# Altium schematic sheet lcd.SchDoc
size A4
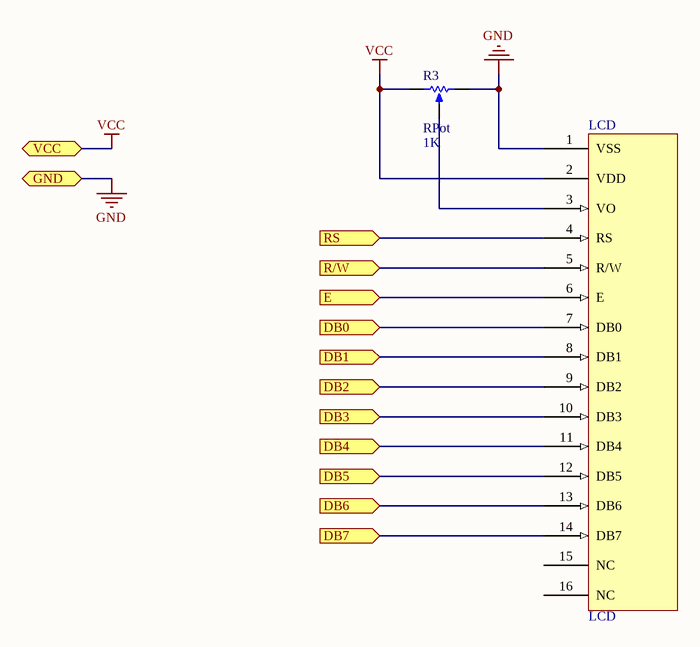
[diagram p0: lcd.SchDoc]

## Parts
LCD  LCD  [IDC16]
R3  RPot  value 1K  [trimpot]

## Ports
DB0 (in), DB1 (in), DB2 (in), DB3 (in), DB4 (in), DB5 (in), DB6 (in), DB7 (in), E (in), GND, R/W (in), RS (in), VCC

## Nets
GND: LCD.1(VSS) R3.2(BOT) ; port GND
VCC: LCD.2(VDD) R3.1(TOP) ; port VCC
DB0: LCD.7(DB0) ; port DB0
DB1: LCD.8(DB1) ; port DB1
DB2: LCD.9(DB2) ; port DB2
DB3: LCD.10(DB3) ; port DB3
DB4: LCD.11(DB4) ; port DB4
DB5: LCD.12(DB5) ; port DB5
DB6: LCD.13(DB6) ; port DB6
DB7: LCD.14(DB7) ; port DB7
E: LCD.6(E) ; port E
R/W: LCD.5(R/W) ; port R/W
RS: LCD.4(RS) ; port RS
NetLCD_3: LCD.3(VO) R3.3(TAP)

Not connected (* = marked no-connect by the designer): LCD 15(NC) 16(NC)

## Library data of the parts
R3 = RPot: Potentiometer; Sim Note: Enter the Resistance value and the set point into parameter fields.; Set Position: 0.5; RS: 522-1016; Published: 8-Jun-2000; LatestRevisionDate: 17-Jul-2002; LatestRevisionNote: Re-released for DXP Platform.; PackageReference: VR5; Publisher: Altium Limited; PackageDescription: Variable Resistor, Thru-Hole; 3 Leads